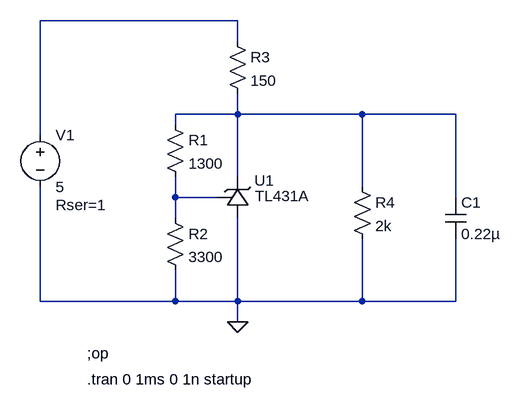
[diagram p0: schematic Draft1.asc]
Draft1.asc, the LTspice schematic file:
Version 4
SHEET 1 880 680
WIRE 192 -96 -112 -96
WIRE 192 -64 192 -96
WIRE 192 48 192 16
WIRE 192 48 96 48
WIRE 384 48 192 48
WIRE 528 48 384 48
WIRE 96 64 96 48
WIRE -112 80 -112 -96
WIRE 192 144 192 48
WIRE 384 160 384 48
WIRE 96 176 96 144
WIRE 160 176 96 176
WIRE 528 176 528 48
WIRE 96 208 96 176
WIRE -112 336 -112 160
WIRE 96 336 96 288
WIRE 96 336 -112 336
WIRE 192 336 192 208
WIRE 192 336 96 336
WIRE 384 336 384 240
WIRE 384 336 192 336
WIRE 528 336 528 240
WIRE 528 336 384 336
WIRE 192 368 192 336
FLAG 192 368 0
SYMBOL res 80 48 R0
SYMATTR InstName R1
SYMATTR Value 1300
SYMBOL res 80 192 R0
SYMATTR InstName R2
SYMATTR Value 3300
SYMBOL res 176 -80 R0
SYMATTR InstName R3
SYMATTR Value 150
SYMBOL voltage -112 64 R0
WINDOW 123 0 0 Left 0
WINDOW 39 24 124 Left 2
SYMATTR SpiceLine Rser=1
SYMATTR InstName V1
SYMATTR Value 5
SYMBOL TL431A 192 176 R0
SYMATTR InstName U1
SYMBOL res 368 144 R0
SYMATTR InstName R4
SYMATTR Value 2k
SYMBOL cap 512 176 R0
SYMATTR InstName C1
SYMATTR Value 0.22µ
TEXT -40 416 Left 2 !;op
TEXT -40 456 Left 2 !.tran 0 1ms 0 1n startup

The netlist it stands for:
* Draft1.asc
R1 N002 N003 1300
R2 N003 0 3300
R3 N001 N002 150
V1 N001 0 5 Rser=1
XU1 0 N002 N003 TL431A
R4 N002 0 2k
C1 N002 0 0.22µ
;op
.tran 0 1ms 0 1n startup
.lib ./TL431_helmut_spice.cir
.backanno
.end